# EAGLE design lcr (EAGLE 8.5.2)
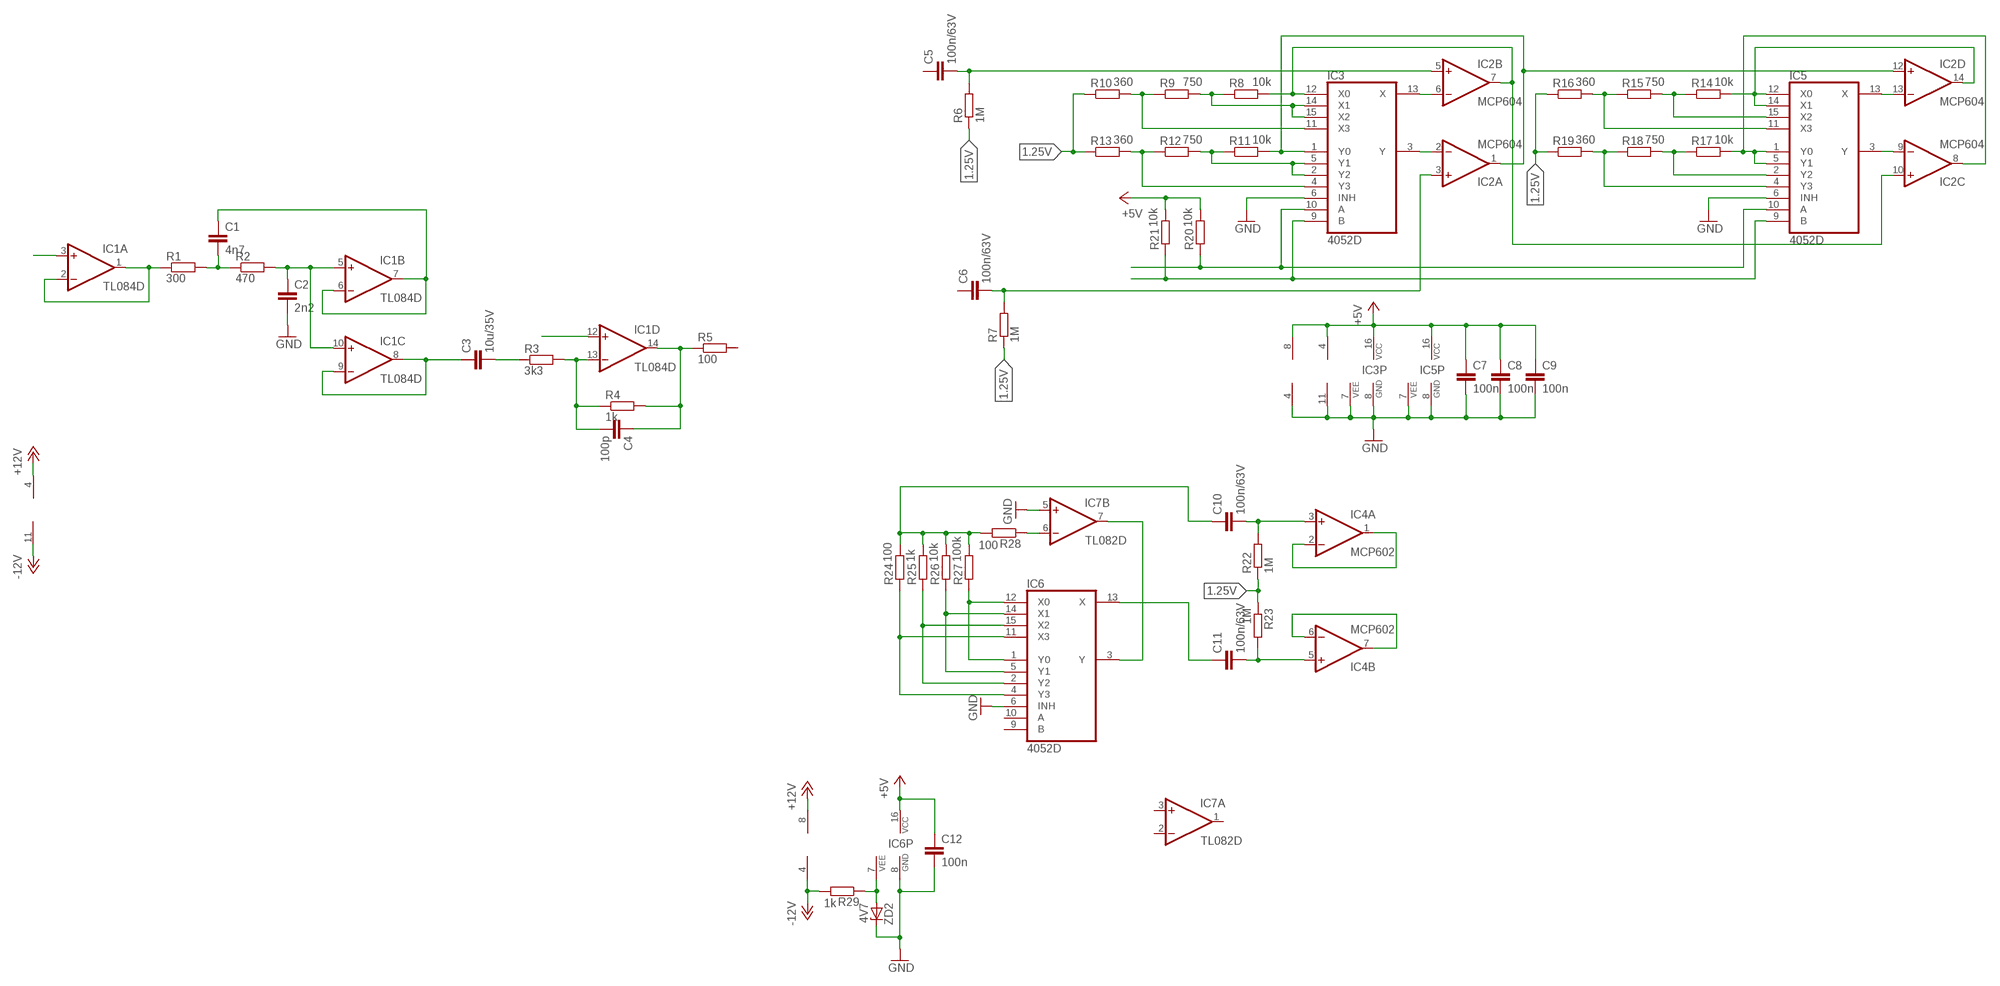
[diagram p0: schematic, sheet 1]

## Parts
C1  4n7  C-EUC0603K  [C0603K]
C2  2n2  C-EUC0603K  [C0603K]
C3  10u/35V  C-EUC1206K  [C1206K]
C4  100p  C-EUC0603K  [C0603K]
C5  100n/63V  C-EUC1206K  [C1206K]
C6  100n/63V  C-EUC1206K  [C1206K]
C7  100n  C-EUC0603K  [C0603K]
C8  100n  C-EUC0603K  [C0603K]
C9  100n  C-EUC0603K  [C0603K]
C10  100n/63V  C-EUC1206K  [C1206K]
C11  100n/63V  C-EUC1206K  [C1206K]
C12  100n  C-EUC0603K  [C0603K]
IC1  TL084D  [SO14]
IC2  MCP604  TL084D  [SO14]
IC3  4052D  [SO16]
IC4  MCP602  LM358D  [SO08]
IC5  4052D  [SO16]
IC6  4052D  [SO16]
IC7  TL082D  [SO08]
R1  300  R-EU_R0603  [R0603]
R2  470  R-EU_R0603  [R0603]
R3  3k3  R-EU_R0603  [R0603]
R4  1k  R-EU_R0603  [R0603]
R5  100  R-EU_R0603  [R0603]
R6  1M  R-EU_R0603  [R0603]
R7  1M  R-EU_R0603  [R0603]
R8  10k  R-EU_R0603  [R0603]
R9  750  R-EU_R0603  [R0603]
R10  360  R-EU_R0603  [R0603]
R11  10k  R-EU_R0603  [R0603]
R12  750  R-EU_R0603  [R0603]
R13  360  R-EU_R0603  [R0603]
R14  10k  R-EU_R0603  [R0603]
R15  750  R-EU_R0603  [R0603]
R16  360  R-EU_R0603  [R0603]
R17  10k  R-EU_R0603  [R0603]
R18  750  R-EU_R0603  [R0603]
R19  360  R-EU_R0603  [R0603]
R20  10k  R-EU_R0603  [R0603]
R21  10k  R-EU_R0603  [R0603]
R22  1M  R-EU_R0603  [R0603]
R23  1M  R-EU_R0603  [R0603]
R24  100  R-EU_R0603  [R0603]
R25  1k  R-EU_R0603  [R0603]
R26  10k  R-EU_R0603  [R0603]
R27  100k  R-EU_R0603  [R0603]
R28  100  R-EU_R0603  [R0603]
R29  1k  R-EU_R0603  [R0603]
ZD2  4V7  ZD-A1-C3  [SOT23]

## Nets
1.25V: R6.1 R7.1 R10.1 R13.1 R16.1 R19.1 R22.1 R23.1
+5V: C7.1 C8.1 C9.1 C12.1 IC2.4(P:V+) IC3.16(VCC) IC4.8(P:V+) IC5.16(VCC) IC6.16(VCC) R20.2 R21.2
+12V: IC1.4(P:V+) IC7.8(P:V+)
-12V: IC1.11(P:V-) IC7.4(P:V-) R29.2
GND: C2.2 C7.2 C8.2 C9.2 C12.2 IC2.11(P:V-) IC3.6(INH) IC3.7(VEE) IC3.8(GND) IC4.4(P:V-) IC5.6(INH) IC5.7(VEE) IC5.8(GND) IC6.6(INH) IC6.8(GND) IC7.5(B:+IN) ZD2.3(C)
N$1: IC1.1(A:OUT) IC1.2(A:-IN) R1.1
N$2: C1.2 R1.2 R2.1
N$3: C2.1 IC1.5(B:+IN) IC1.10(C:+IN) R2.2
N$4: C1.1 IC1.6(B:-IN) IC1.7(B:OUT)
N$5: C5.2 IC2.5(B:+IN) R6.2
N$6: C3.1 IC1.8(C:OUT) IC1.9(C:-IN)
N$7: C3.2 R3.1
N$8: C4.2 IC1.13(D:-IN) R3.2 R4.1
N$9: C4.1 IC1.14(D:OUT) R4.2 R5.1
N$10: C6.2 IC2.3(A:+IN) R7.2
N$11: IC3.4(Y3) R12.1 R13.2
N$12: IC3.11(X3) R9.1 R10.2
N$13: IC2.7(B:OUT) IC2.10(C:+IN) IC3.12(X0) R8.2
N$14: IC3.2(Y2) IC3.5(Y1) R11.1 R12.2
N$15: IC3.14(X1) IC3.15(X2) R8.1 R9.2
N$16: IC2.1(A:OUT) IC2.12(D:+IN) IC3.1(Y0) R11.2
N$17: IC2.6(B:-IN) IC3.13(X)
N$18: IC2.9(C:-IN) IC5.3(Y)
N$19: IC3.9(B) IC5.9(B) R21.1
N$20: IC2.2(A:-IN) IC3.3(Y)
N$21: IC2.14(D:OUT) IC5.12(X0) IC5.14(X1) R14.2
N$22: IC5.4(Y3) R18.1 R19.2
N$23: IC5.11(X3) R15.1 R16.2
N$24: IC5.2(Y2) R17.1 R18.2
N$25: C10.2 IC4.3(A:+IN) R22.2
N$26: IC2.8(C:OUT) IC5.1(Y0) IC5.5(Y1) R17.2
N$27: IC3.10(A) IC5.10(A) R20.1
N$28: IC5.15(X2) R14.1 R15.2
N$29: IC2.13(D:-IN) IC5.13(X)
N$30: C11.2 IC4.5(B:+IN) R23.2
N$31: IC4.6(B:-IN) IC4.7(B:OUT)
N$32: IC4.1(A:OUT) IC4.2(A:-IN)
N$33: IC6.3(Y) IC7.7(B:OUT)
N$34: IC7.6(B:-IN) R28.1
N$35: C10.1 R24.2 R25.2 R26.2 R27.2 R28.2
N$36: IC6.1(Y0) IC6.12(X0) R27.1
N$37: IC6.5(Y1) IC6.14(X1) R26.1
N$38: IC6.2(Y2) IC6.15(X2) R25.1
N$39: IC6.4(Y3) IC6.11(X3) R24.1
N$40: C11.1 IC6.13(X)
N$41: IC6.7(VEE) R29.1 ZD2.1(A)
N$42: IC1.3(A:+IN)
N$43: IC1.12(D:+IN)
Unconnected: C5.1 C6.1 IC6.9(B) IC6.10(A) IC7.1(A:OUT) IC7.2(A:-IN) IC7.3(A:+IN) R5.2

## Library data of the parts
C1-C12 = rcl:C-EU: CAPACITOR, European symbol
IC1 IC2 = linear:TL084: OP AMP
IC3 IC5 IC6 = 40xx:4052: Dual 4-channel ANALOG MULTIPLEXER
IC4 = linear:LM358: OP AMP also LM158; LM258; LM2904 Source: http://cache.national.com/ds/LM/LM158.pdf
IC7 = linear:TL082: OP AMP Data sheet <http://www.ti.com/lit/ds/symlink/tl084a . pdf>; DATA_SHEET: <a href="http://www.ti.com/lit/ds/symlink/tl084a.pdf"> Data sheet </a>
R1-R29 = rcl:R-EU_: RESISTOR, European symbol
ZD2 = diodes:ZD-: Zener diode

## Board
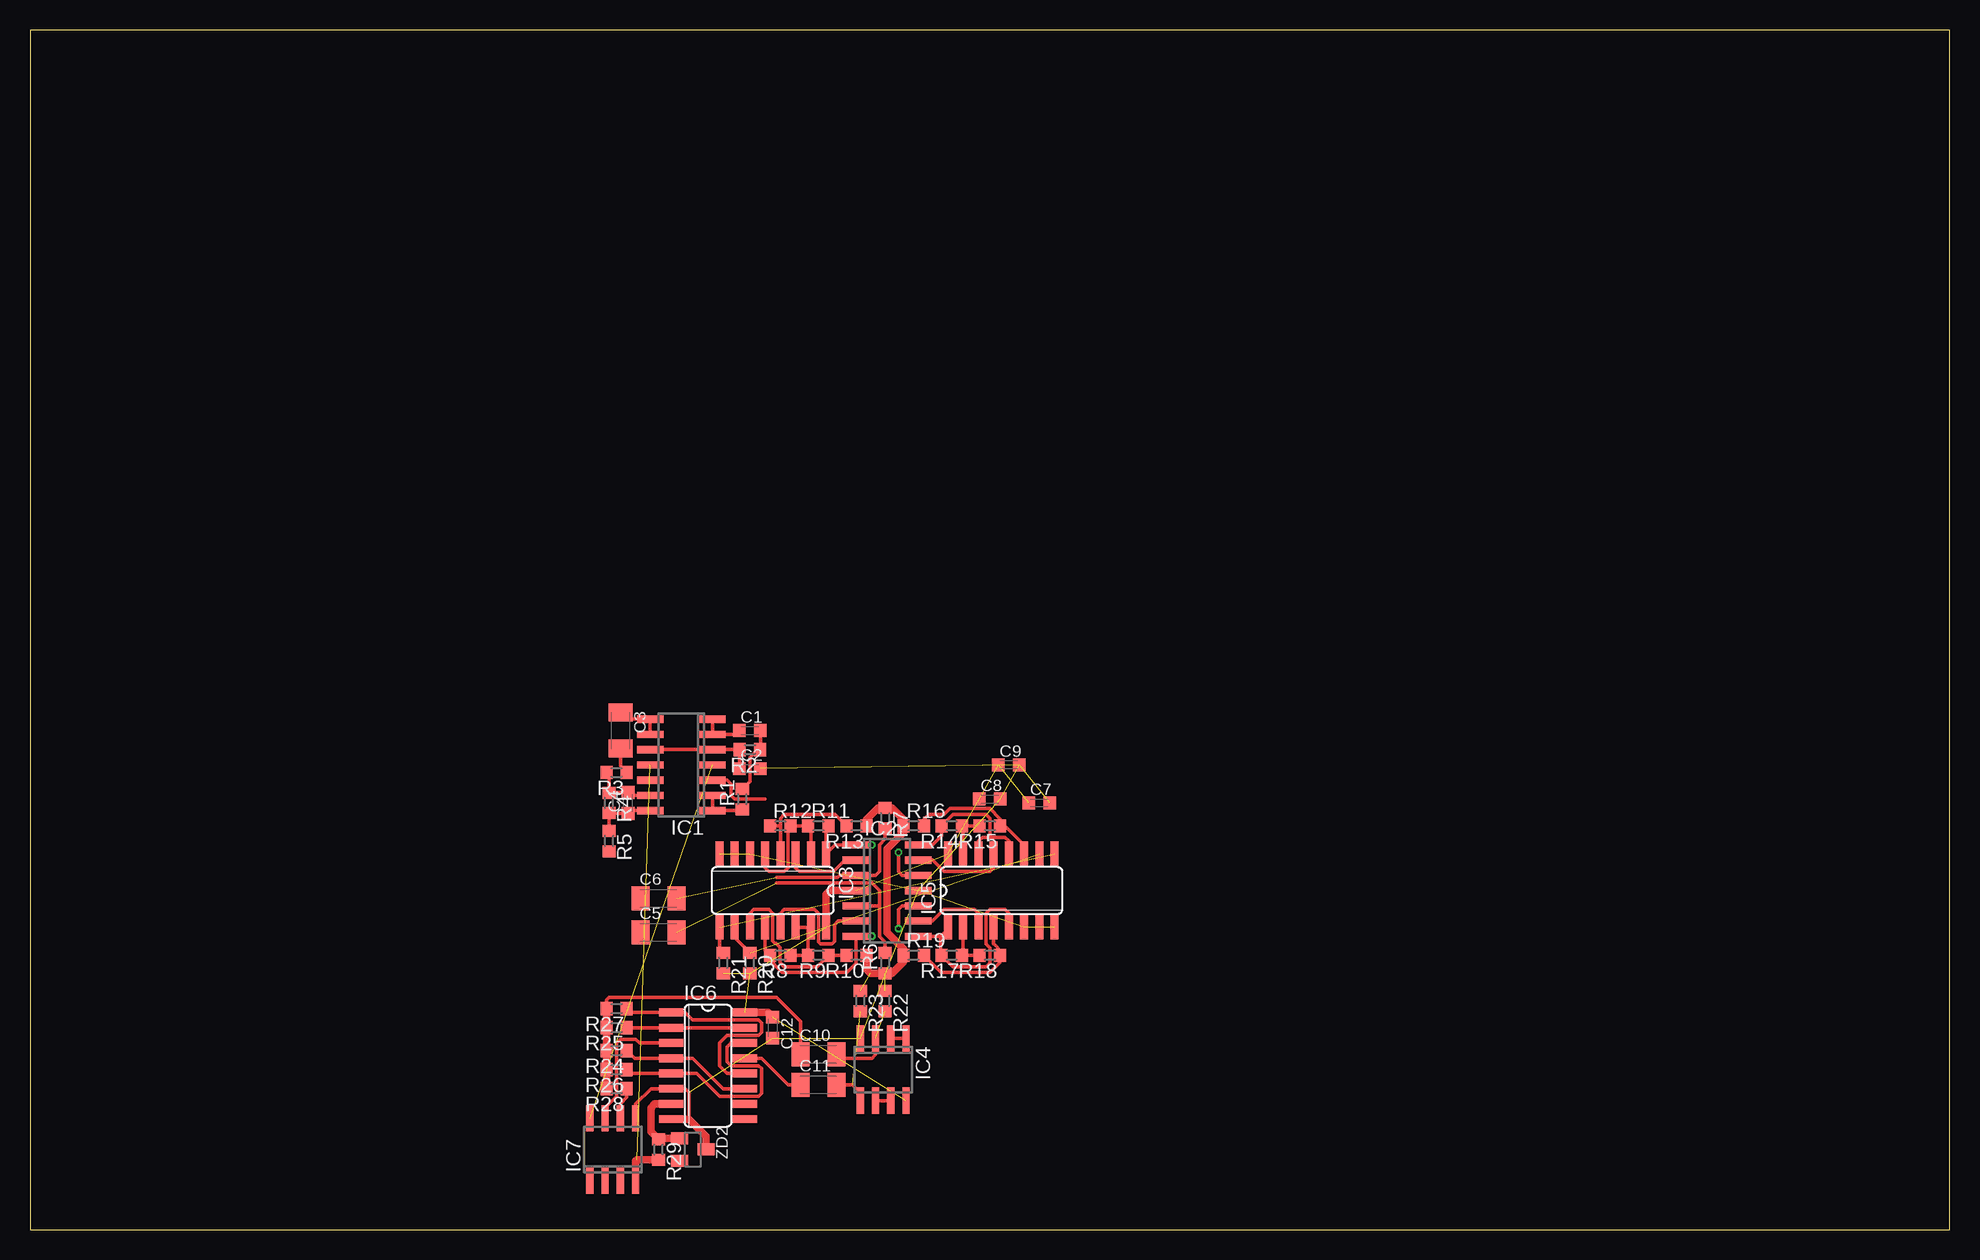
[diagram p1: board, top side]
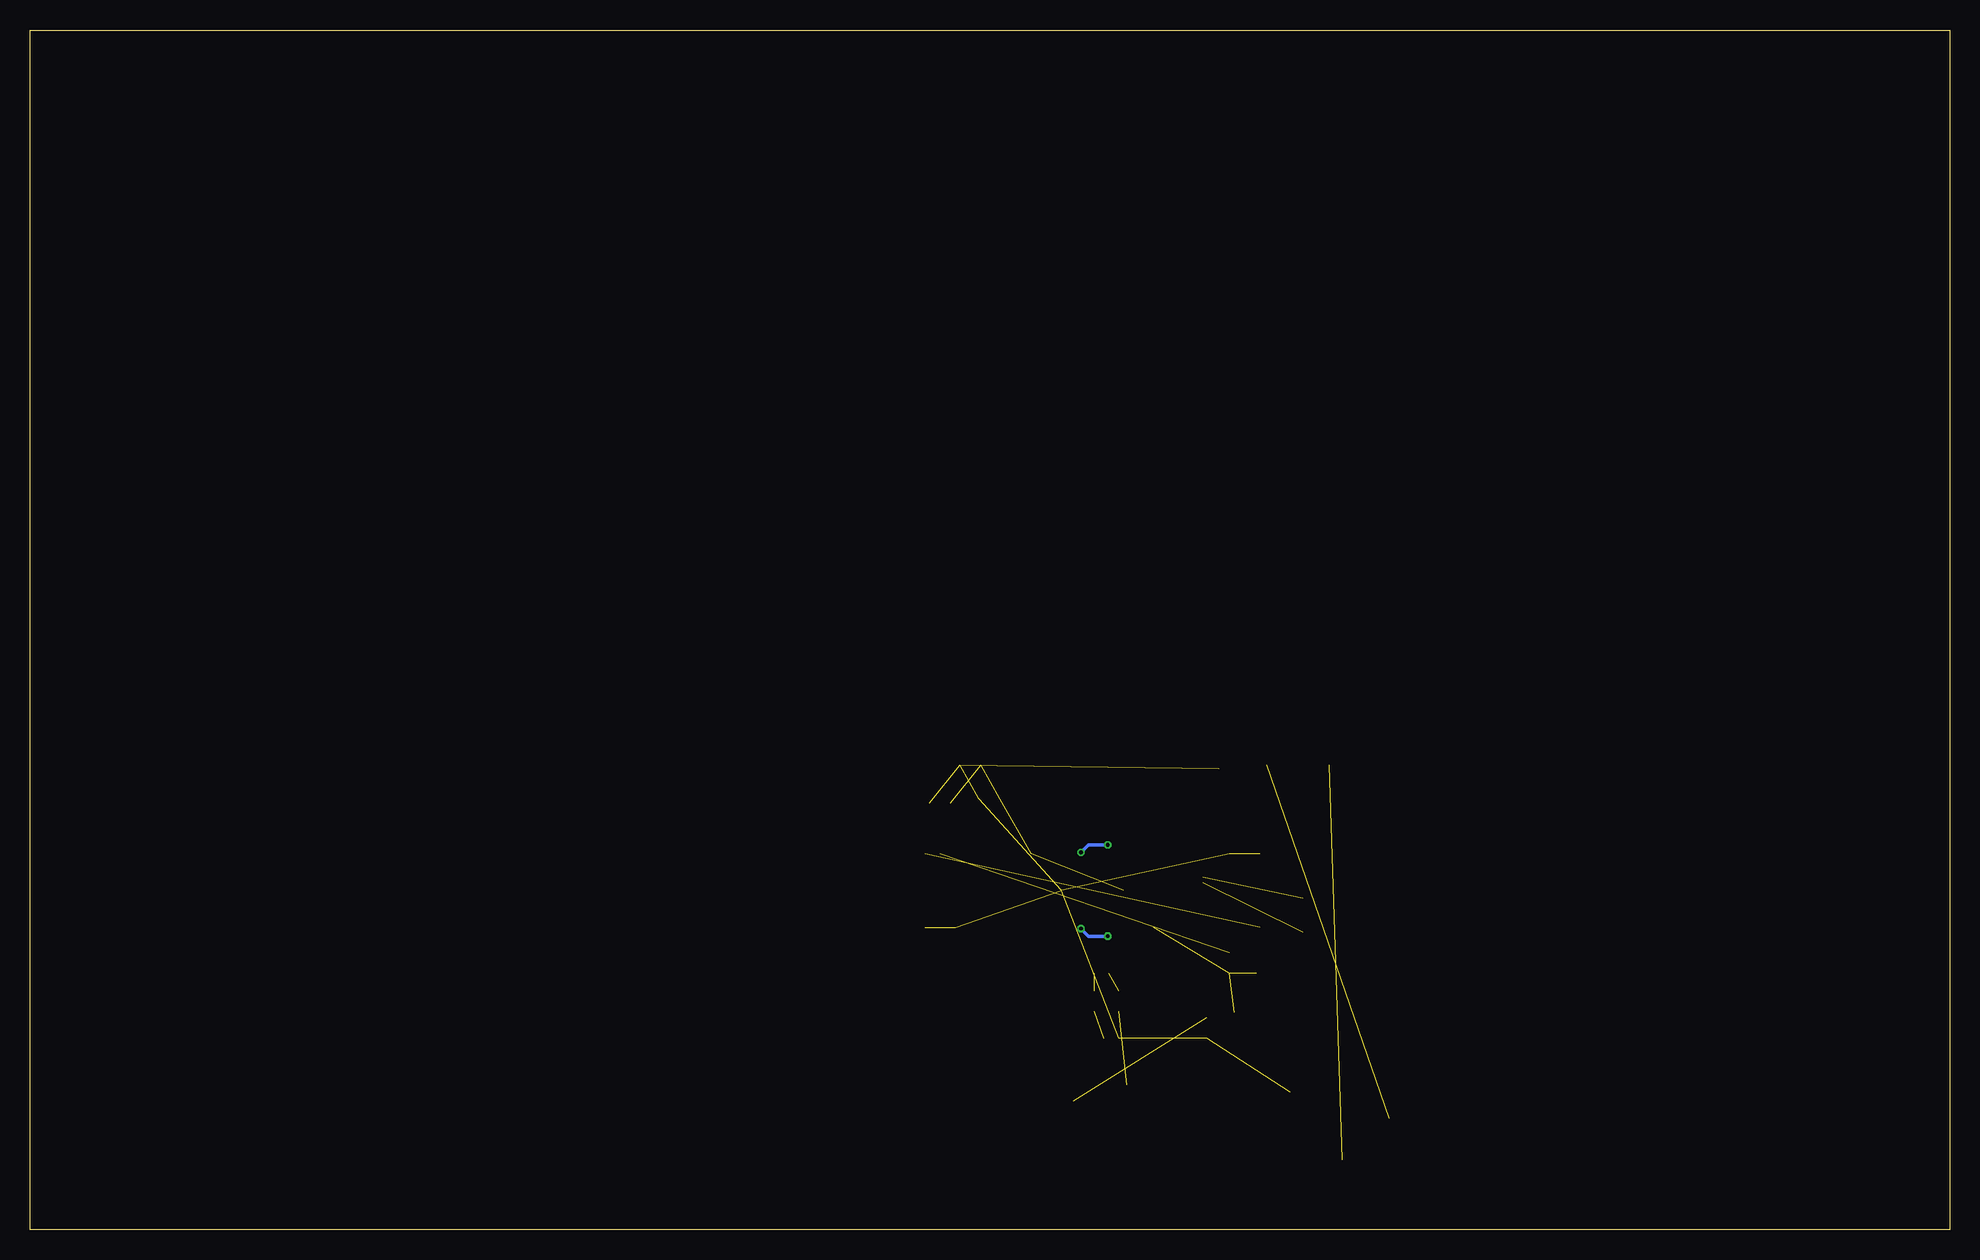
[diagram p2: board, bottom side, seen from below]

Size 160 x 100 mm. Coordinates in mm from the lower left corner, seen from the top.
Outline: 0,0 160,0 160,100 0,100 0,0
Copper layers (1*16): Top 0.035mm / dielectric 1.6mm / Bottom 0.035mm
Design rules "Elecrow_2-layer_PCB_eagle_rule": minimum track width 6mil, minimum drill 12mil, track to track 6mil, track to pad 6mil, pad to pad 6mil, via to via 8mil, smd to smd 0mil, copper to edge 20mil, drill to drill 10mil, minimum pad ring 6mil, minimum via ring 6mil, stop-mask expansion 0mil, vias tented up to drill 100mil, thermal gap 10mil

### Footprints (pad centres in the part's own frame; a part is rotated, then mirrored left to right if it is on the bottom)
C0603K = smd 1.05 x 1.08: 1 -0.875,0; 2 0.875,0
C1206K = smd 1.5 x 2: 1 -1.5,0; 2 1.5,0
SO14 = smd 0.6 x 2.2: 1 -3.81,-2.6; 2 -2.54,-2.6; 3 -1.27,-2.6; 4 0,-2.6; 5 1.27,-2.6; 6 2.54,-2.6; 7 3.81,-2.6; 8 3.81,2.6; 9 2.54,2.6; 10 1.27,2.6; 11 0,2.6; 12 -1.27,2.6; 13 -2.54,2.6; 14 -3.81,2.6
SO16 = smd 0.66 x 2.032: 1 -4.445,-3.073; 2 -3.175,-3.073; 3 -1.905,-3.073; 4 -0.635,-3.073; 5 0.635,-3.073; 6 1.905,-3.073; 7 3.175,-3.073; 8 4.445,-3.073; 9 4.445,3.073; 10 3.175,3.073; 11 1.905,3.073; 12 0.635,3.073; 13 -0.635,3.073; 14 -1.905,3.073; 15 -3.175,3.073; 16 -4.445,3.073
SO08 = smd 0.6 x 2.2: 1 -1.905,-2.6; 2 -0.635,-2.6; 3 0.635,-2.6; 4 1.905,-2.6; 5 1.905,2.6; 6 0.635,2.6; 7 -0.635,2.6; 8 -1.905,2.6
R0603 = smd 1 x 1.1: 1 -0.85,0; 2 0.85,0
SOT23 = smd 1 x 1.4: 1 -0.95,-1.1; 2 0.95,-1.1; 3 0,1.1

### Placement (x,y rotation side)
C1  60.01,41.59 0 top
C2  60.01,38.42 0 top
C3  49.21,41.59 270 top
C4  49.85,35.56 90 top
C5  52.39,24.77 0 top
C6  52.39,27.62 0 top
C7  84.14,35.56 0 top
C8  80.01,35.88 0 top
C9  81.6,38.73 0 top
C10  65.72,14.61 0 top
C11  65.72,12.06 0 top
C12  61.91,16.83 270 top
IC1  54.29,38.73 90 top
IC2  71.44,28.26 270 top
IC3  61.91,28.26 180 top
IC4  71.12,13.34 180 top
IC5  80.96,28.26 0 top
IC6  56.52,13.65 270 top
IC7  48.58,6.67 0 top
R1  59.37,35.88 90 top
R2  60.01,40.01 180 top
R3  48.9,38.1 180 top
R4  48.26,35.56 270 top
R5  48.26,32.38 270 top
R6  71.28,22.23 90 top
R7  71.28,34.29 270 top
R8  62.55,22.86 180 top
R9  65.72,22.86 180 top
R10  68.9,22.86 180 top
R11  65.72,33.66 0 top
R12  62.55,33.66 0 top
R13  68.9,33.66 180 top
R14  76.83,33.66 180 top
R15  80.01,33.66 180 top
R16  73.66,33.66 0 top
R17  76.83,22.86 180 top
R18  80.01,22.86 180 top
R19  73.66,22.86 0 top
R20  60.01,22.23 270 top
R21  57.78,22.23 270 top
R22  71.28,19.05 270 top
R23  69.22,19.05 270 top
R24  48.9,14.92 180 top
R25  48.9,16.83 180 top
R26  48.9,13.34 180 top
R27  48.9,18.41 180 top
R28  48.9,11.75 180 top
R29  52.39,6.67 270 top
ZD2  55.24,6.67 270 top

### Tracks (layer width: path | path; a pad name or v marks a point on that pad's centre or on a via)
1.25V  (2 unrouted)
  Top 0.61: R10.1 69.75,21.69 70.06,21.38 R6.1 71.86,21.38 72.81,22.33 R19.1 72.81,23.39 71.44,24.77 71.44,31.75 72.81,33.12 R16.1 72.81,34.19 71.86,35.14 R7.1 70.7,35.14 69.75,34.19 R13.1
+5V  (8 unrouted)
  Top 0.61: IC2.4 66.67,28.26 66.36,27.94 IC3.16 | IC6.16 61.52,18.1 C12.1
+12V  (1 unrouted)
-12V  (1 unrouted)
  Top 0.61: IC7.4 50.48,5.71 50.59,5.82 R29.2
GND  (13 unrouted)
  Top 0.305: IC7.5 50.48,10.48 51.75,11.75 IC6.6 54.61,11.75 54.93,11.43 54.93,9.21
  Top 0.61: IC6.8 54.93,9.21 56.34,7.79 ZD2.3
N$1
  Top 0.305: IC1.2 IC1.1 59.27,34.92 R1.1
N$2
  Top 0.305: R1.2 60.01,37.36 60.01,39.37 60.64,40.01 R2.1 60.88,40.03 C1.2
N$3
  Top 0.305: C2.1 59.13,39.98 R2.2 IC1.5 IC1.10
N$4
  Top 0.305: IC1.7 IC1.6 58.81,41.27 C1.1
N$5  (1 unrouted)
  Top 0.305: 69.85,26.99 IC2.5 70.8,26.99 | 62.23,28.89 70.17,28.89 70.8,28.26 70.8,26.99 | R6.2 71.28,23.97 70.8,24.45 70.8,26.99
N$6
  Top 0.305: IC1.9 IC1.8 49.76,42.55 C3.1
N$7
  Top 0.305: C3.2 49.21,38.63 R3.1
N$8
  Top 0.305: R4.1 48.26,36.51 | 48.26,36.51 48.26,37.88 R3.2 | IC1.13 50.09,36.2 C4.2 48.34,36.44 48.26,36.51
N$9
  Top 0.305: IC1.14 50.09,34.92 C4.1 48.28,34.69 R4.2 R5.1
N$10  (1 unrouted)
  Top 0.305: 62.23,29.37 67.31,29.37 67.47,29.53 IC2.3 70.48,29.53 70.8,29.84 70.8,32.07 71.28,32.54 R7.2
N$11
  Top 0.305: IC3.4 62.55,33.66 | 62.55,33.66 62.55,34.29 62.87,34.61 67.1,34.61 67.38,34.33 R13.2 | R12.1 62.55,33.66
N$12
  Top 0.305: R10.2 R9.1 65.62,21.91 62.87,21.91 62.5,22.27 62.5,23.54 62.23,23.81 62.18,23.86 62.09,23.86 61.91,24.04 61.91,26.35 61.59,26.67 60.33,26.67 60.01,26.35 IC3.11
N$13  (via drill 0.3)
  Top 0.305: IC3.12 61.28,23.28 R8.2 61.7,22.44 62.05,22.09 62.05,22.08 62.7,21.43 68.1,21.43 68.85,22.18 68.85,23.54 68.84,23.55 IC2.7 | IC2.7 68.9,24.39 | IC2.7 v70.17,24.45 | v72.39,25.08 72.39,26.67 72.71,26.99 IC2.10
  Bottom 0.305: v70.17,24.45 71.75,24.45 v72.39,25.08
N$14
  Top 0.305: 63.5,33.66 R11.1 65.09,33.44 IC3.2 | 63.5,33.66 R12.2 | IC3.5 61.28,30.16 61.59,29.84 62.87,29.84 63.18,30.16 63.18,33.34 63.5,33.66
N$15
  Top 0.305: IC3.14 IC3.15 64.87,24.97 R9.2 R8.1
N$16  (via drill 0.3)
  Top 0.305: R11.2 66.36,33.44 IC3.1 67.09,32.07 IC2.1 v70.17,32.07 | v72.39,31.43 72.39,29.84 72.71,29.53 IC2.12
  Bottom 0.305: v70.17,32.07 71.75,32.07 v72.39,31.43
N$17
  Top 0.305: IC2.6 67.36,25.72 67.04,25.4 67.04,24.02 66.83,23.81 66.67,23.81 65.88,23.81 65.72,23.97 65.72,26.35 65.41,26.67 62.87,26.67 62.55,26.35 IC3.13
N$18
  Top 0.305: IC2.9 75.25,25.72 76.2,26.67 78.74,26.67 79.06,26.35 IC5.3
N$19  (1 unrouted)
  Top 0.305: IC3.9 57.47,23.39 R21.1
N$20
  Top 0.305: IC2.2 67.94,30.8 66.99,29.84 64.14,29.84 63.82,30.16 IC3.3
N$21
  Top 0.305: IC5.12 81.6,32.38 81.28,32.7 80.01,32.7 | 80.01,32.7 79.38,32.7 79.06,32.38 IC5.14 | 80.01,32.7 80.01,34.29 79.69,34.61 76.94,34.61 R14.2 75.98,32.8 75.25,32.07 IC2.14
N$22
  Top 0.305: IC5.4 80.33,23.82 80.47,23.68 80.47,23.67 80.86,23.28 R18.1 80.86,22.28 80.01,21.43 75.93,21.43 75.18,22.18 74.86,22.51 R19.2
N$23
  Top 0.305: IC5.11 82.87,32.07 81.28,33.66 R15.1 80.86,34.23 80.01,35.08 76.68,35.08 76.2,34.61 74.93,34.61 74.51,34.19 R16.2
N$24
  Top 0.305: R18.2 77.79,22.86 | 77.79,22.86 R17.1 | IC5.2 77.79,22.86
N$25  (1 unrouted)
  Top 0.305: IC4.3 70.48,14.61 70.17,14.29 67.54,14.29 C10.2
N$26
  Top 0.305: 75.88,24.45 75.88,22.96 R17.2 76.94,21.91 79.69,21.91 80.01,22.23 80.01,23.5 79.69,23.81 79.69,26.35 80.01,26.67 81.28,26.67 81.6,26.35 IC5.5 | 75.88,24.45 IC2.8 | 75.88,24.45 76.52,25.08 IC5.1
N$27  (1 unrouted)
  Top 0.305: IC3.10 58.74,24.34 R20.1
N$28
  Top 0.305: IC5.15 77.79,33.55 R14.1 R15.2
N$29
  Top 0.305: IC2.13 75.25,30.8 76.2,29.84 80.01,29.84 80.33,30.16 IC5.13
N$30  (1 unrouted)
  Top 0.305: IC4.5 69.22,11.43 68.58,12.06 C11.2
N$31
  Top 0.305: IC4.6 IC4.7
N$32
  Top 0.305: IC4.2 IC4.1
N$33
  Top 0.305: IC6.3 50.8,15.56 50.48,15.88 49.21,15.88 48.9,15.56 48.9,11.11 47.94,10.16 IC7.7
N$34
  Top 0.305: IC7.6 49.21,10.48 49.74,11.01 R28.1
N$35
  Top 0.305: C10.1 64.22,17.38 62.23,19.37 48.26,19.37 48.05,19.15 R27.2
  Top 0.61: R28.2 R26.2 R24.2 R25.2 R27.2
N$36
  Top 0.305: R27.1 50.06,18.1 IC6.1 54.61,18.1 55.24,17.46 60.73,17.46 60.96,17.23 60.96,16.42 60.73,16.19 58.1,16.19 57.47,15.56 57.47,13.65 58.1,13.02 IC6.12
N$37
  Top 0.305: R26.1 50.06,13.02 IC6.5 55.56,13.02 57.47,11.11 60.73,11.11 60.96,11.34 60.96,13.42 60.73,13.65 58.42,13.65 58.1,13.97 58.1,15.24 58.42,15.56 IC6.14
N$38
  Top 0.305: R25.1 IC6.2 IC6.15
N$39
  Top 0.305: R24.1 50.38,14.29 IC6.4 55.24,14.29 57.78,11.75 IC6.11
N$40
  Top 0.305: IC6.13 60.96,14.29 63.18,12.06 C11.1
N$41
  Top 0.61: IC6.7 52.07,10.48 51.75,10.16 51.75,8.15 R29.1 52.49,7.62 ZD2.1
N$42
  Top 0.305: IC1.3 58.1,37.47 58.42,37.15 58.42,36.2 58.74,35.88 61.28,35.88